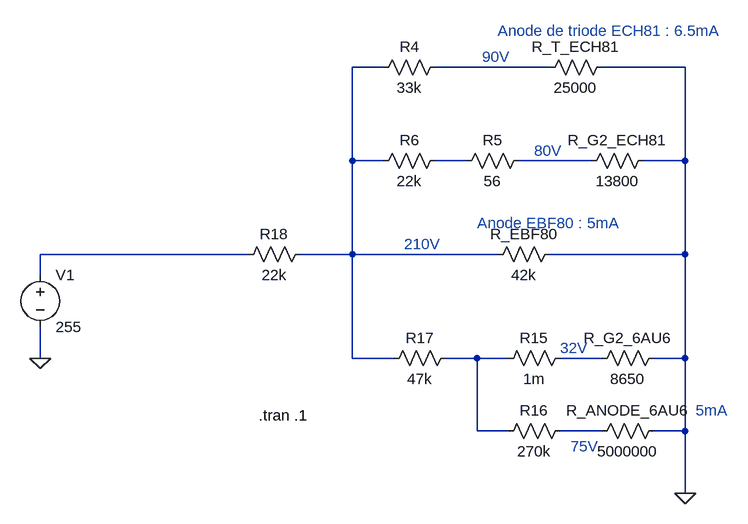
[diagram p0: schematic AlimRomance57.asc]
AlimRomance57.asc, the LTspice schematic file:
Version 4
SHEET 1 884 816
WIRE 272 -128 224 -128
WIRE 528 -128 352 -128
WIRE 736 -128 608 -128
WIRE 224 16 224 -128
WIRE 272 16 224 16
WIRE 400 16 352 16
WIRE 592 16 480 16
WIRE 736 16 736 -128
WIRE 736 16 672 16
WIRE 64 160 -256 160
WIRE 224 160 224 16
WIRE 224 160 144 160
WIRE 448 160 224 160
WIRE 736 160 736 16
WIRE 736 160 528 160
WIRE -256 192 -256 160
WIRE -256 320 -256 272
WIRE 224 320 224 160
WIRE 288 320 224 320
WIRE 416 320 368 320
WIRE 464 320 416 320
WIRE 608 320 544 320
WIRE 736 320 736 160
WIRE 736 320 688 320
WIRE 416 432 416 320
WIRE 464 432 416 432
WIRE 608 432 544 432
WIRE 736 432 736 320
WIRE 736 432 688 432
WIRE 736 528 736 432
FLAG -256 320 0
FLAG 736 528 0
SYMBOL res 544 144 R90
WINDOW 0 0 56 VBottom 2
WINDOW 3 32 56 VTop 2
SYMATTR InstName R_EBF80
SYMATTR Value 42k
SYMBOL voltage -256 176 R0
WINDOW 123 0 0 Left 0
WINDOW 39 0 0 Left 0
SYMATTR InstName V1
SYMATTR Value 255
SYMBOL res 368 0 R90
WINDOW 0 0 56 VBottom 2
WINDOW 3 32 56 VTop 2
SYMATTR InstName R6
SYMATTR Value 22k
SYMBOL res 368 -144 R90
WINDOW 0 0 56 VBottom 2
WINDOW 3 32 56 VTop 2
SYMATTR InstName R4
SYMATTR Value 33k
SYMBOL res 384 304 R90
WINDOW 0 0 56 VBottom 2
WINDOW 3 32 56 VTop 2
SYMATTR InstName R17
SYMATTR Value 47k
SYMBOL res 560 304 R90
WINDOW 0 0 56 VBottom 2
WINDOW 3 32 56 VTop 2
SYMATTR InstName R15
SYMATTR Value 1m
SYMBOL res 560 416 R90
WINDOW 0 0 56 VBottom 2
WINDOW 3 32 56 VTop 2
SYMATTR InstName R16
SYMATTR Value 270k
SYMBOL res 624 -144 R90
WINDOW 0 0 56 VBottom 2
WINDOW 3 32 56 VTop 2
SYMATTR InstName R_T_ECH81
SYMATTR Value 25000
SYMBOL res 496 0 R90
WINDOW 0 0 56 VBottom 2
WINDOW 3 32 56 VTop 2
SYMATTR InstName R5
SYMATTR Value 56
SYMBOL res 688 0 R90
WINDOW 0 0 56 VBottom 2
WINDOW 3 32 56 VTop 2
SYMATTR InstName R_G2_ECH81
SYMATTR Value 13800
SYMBOL res 704 304 R90
WINDOW 0 0 56 VBottom 2
WINDOW 3 32 56 VTop 2
SYMATTR InstName R_G2_6AU6
SYMATTR Value 8650
SYMBOL res 704 416 R90
WINDOW 0 0 56 VBottom 2
WINDOW 3 32 56 VTop 2
SYMATTR InstName R_ANODE_6AU6
SYMATTR Value 5000000
SYMBOL res 160 144 R90
WINDOW 0 0 56 VBottom 2
WINDOW 3 32 56 VTop 2
SYMATTR InstName R18
SYMATTR Value 22k
TEXT 80 408 Left 2 !.tran .1
TEXT 416 112 Left 2 ;Anode EBF80 : 5mA
TEXT 448 -184 Left 2 ;Anode de triode ECH81 : 6.5mA
TEXT 424 -144 Left 2 ;90V
TEXT 504 0 Left 2 ;80V
TEXT 304 144 Left 2 ;210V
TEXT 544 304 Left 2 ;32V
TEXT 560 456 Left 2 ;75V
TEXT 752 400 Left 2 ;5mA

The netlist it stands for:
* AlimRomance57.asc
R_EBF80 0 N001 42k
V1 N005 0 255
R6 N003 N001 22k
R4 N002 N001 33k
R17 N006 N001 47k
R15 N007 N006 1m
R16 N008 N006 270k
R_T_ECH81 0 N002 25000
R5 N004 N003 56
R_G2_ECH81 0 N004 13800
R_G2_6AU6 0 N007 8650
R_ANODE_6AU6 0 N008 5000000
R18 N001 N005 22k
.tran .1
* Anode EBF80 : 5mA
* Anode de triode ECH81 : 6.5mA
* 90V
* 80V
* 210V
* 32V
* 75V
* 5mA
.backanno
.end